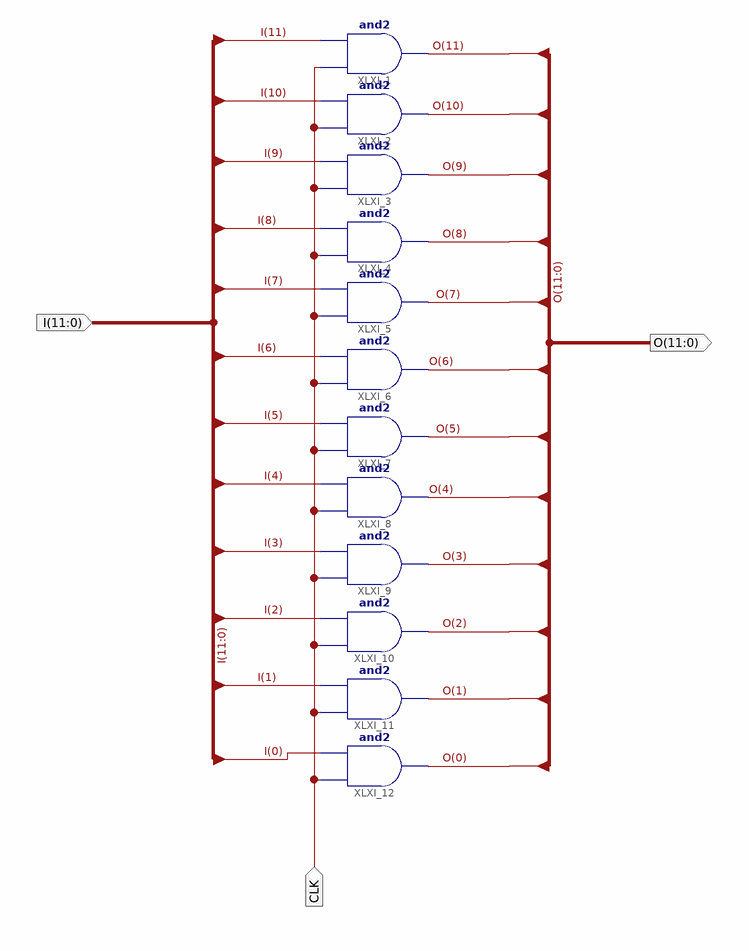
[diagram p0: schematic sheet 1]
// Xilinx ISE schematic Decoder_In.sch (spartan3e) as structural Verilog: 12 symbols, 3 ports
module Decoder_In (
  input  CLK,
  input  [11:0] I,
  output [11:0] O
);

  and XLXI_1 (O[11], CLK, I[11]);
  and XLXI_2 (O[10], CLK, I[10]);
  and XLXI_3 (O[9], CLK, I[9]);
  and XLXI_4 (O[8], CLK, I[8]);
  and XLXI_5 (O[7], CLK, I[7]);
  and XLXI_6 (O[6], CLK, I[6]);
  and XLXI_7 (O[5], CLK, I[5]);
  and XLXI_8 (O[4], CLK, I[4]);
  and XLXI_9 (O[3], CLK, I[3]);
  and XLXI_10 (O[2], CLK, I[2]);
  and XLXI_11 (O[1], CLK, I[1]);
  and XLXI_12 (O[0], CLK, I[0]);
endmodule
